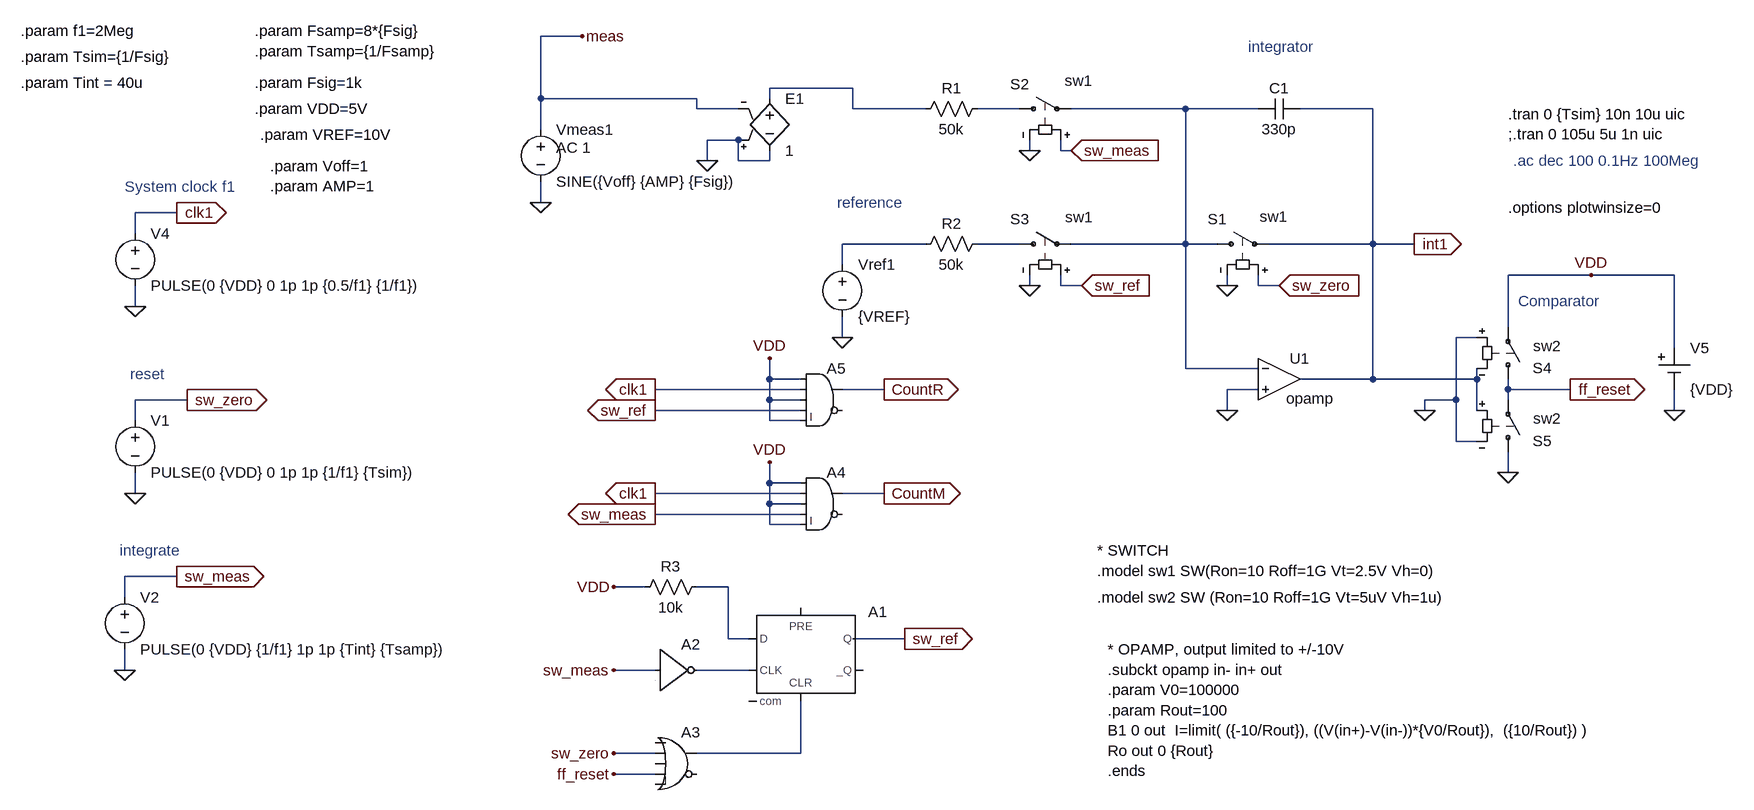
[diagram p0: schematic Dualslope_Integrating_RJI.asc]
Dualslope_Integrating_RJI.asc, the LTspice schematic file:
Version 4
SHEET 1 1400 1012
WIRE -672 -608 -736 -608
WIRE -256 -528 -384 -528
WIRE -736 -512 -736 -608
WIRE -496 -512 -736 -512
WIRE -384 -512 -384 -528
WIRE -496 -496 -496 -512
WIRE -432 -496 -496 -496
WIRE -256 -496 -256 -528
WIRE -144 -496 -256 -496
WIRE 0 -496 -64 -496
WIRE 256 -496 80 -496
WIRE 368 -496 256 -496
WIRE 544 -496 432 -496
WIRE -736 -464 -736 -512
WIRE -432 -448 -480 -448
WIRE 16 -432 16 -448
WIRE 64 -432 64 -448
WIRE 80 -432 64 -432
WIRE -480 -416 -480 -448
WIRE -432 -416 -432 -448
WIRE -384 -416 -384 -432
WIRE -384 -416 -432 -416
WIRE -736 -352 -736 -384
WIRE -1296 -336 -1360 -336
WIRE -1360 -304 -1360 -336
WIRE -144 -288 -272 -288
WIRE 0 -288 -64 -288
WIRE 256 -288 256 -496
WIRE 256 -288 80 -288
WIRE 304 -288 256 -288
WIRE 544 -288 544 -496
WIRE 544 -288 384 -288
WIRE 608 -288 544 -288
WIRE -272 -256 -272 -288
WIRE 880 -240 752 -240
WIRE 1008 -240 880 -240
WIRE 16 -224 16 -240
WIRE 64 -224 64 -240
WIRE 96 -224 64 -224
WIRE 320 -224 320 -240
WIRE 368 -224 368 -240
WIRE 400 -224 368 -224
WIRE -1360 -192 -1360 -224
WIRE 752 -160 752 -240
WIRE -272 -144 -272 -176
WIRE 704 -144 672 -144
WIRE 1008 -128 1008 -240
WIRE 256 -96 256 -288
WIRE 368 -96 256 -96
WIRE -384 -80 -384 -112
WIRE -336 -80 -384 -80
WIRE 544 -80 544 -288
WIRE 544 -80 432 -80
WIRE 704 -80 704 -96
WIRE 704 -80 544 -80
WIRE -336 -64 -560 -64
WIRE -208 -64 -272 -64
WIRE 368 -64 320 -64
WIRE 752 -64 752 -80
WIRE 848 -64 752 -64
WIRE -1280 -48 -1360 -48
WIRE -384 -48 -384 -80
WIRE -336 -48 -384 -48
WIRE 672 -48 672 -144
WIRE 672 -48 624 -48
WIRE 752 -48 752 -64
WIRE -336 -32 -560 -32
WIRE 320 -32 320 -64
WIRE 624 -32 624 -48
WIRE 704 -32 704 -80
WIRE 1008 -32 1008 -64
WIRE -1360 -16 -1360 -48
WIRE -384 -16 -384 -48
WIRE -336 -16 -384 -16
WIRE 672 16 672 -48
WIRE 704 16 672 16
WIRE 752 64 752 32
WIRE -384 80 -384 48
WIRE -336 80 -384 80
WIRE -1360 96 -1360 64
WIRE -336 96 -560 96
WIRE -208 96 -272 96
WIRE -384 112 -384 80
WIRE -336 112 -384 112
WIRE -336 128 -560 128
WIRE -384 144 -384 112
WIRE -336 144 -384 144
WIRE -1296 224 -1376 224
WIRE -576 240 -624 240
WIRE -448 240 -496 240
WIRE -1376 256 -1376 224
WIRE -448 320 -448 240
WIRE -416 320 -448 320
WIRE -176 320 -256 320
WIRE -1376 368 -1376 336
WIRE -560 368 -624 368
WIRE -416 368 -496 368
WIRE -560 496 -624 496
WIRE -336 496 -336 416
WIRE -336 496 -496 496
WIRE -560 528 -624 528
FLAG 16 -432 0
FLAG 16 -224 0
FLAG 80 -432 sw_meas
IOPIN 80 -432 In
FLAG 96 -224 sw_ref
IOPIN 96 -224 In
FLAG 320 -224 0
FLAG 400 -224 sw_zero
IOPIN 400 -224 In
FLAG -736 -352 0
FLAG -272 -144 0
FLAG -1360 96 0
FLAG -1376 368 0
FLAG -1280 -48 sw_zero
IOPIN -1280 -48 Out
FLAG -1296 224 sw_meas
IOPIN -1296 224 Out
FLAG -624 240 VDD
FLAG -624 368 sw_meas
FLAG 848 -64 ff_reset
IOPIN 848 -64 Out
FLAG -624 528 ff_reset
FLAG -176 320 sw_ref
IOPIN -176 320 Out
FLAG -624 496 sw_zero
FLAG -1296 -336 clk1
IOPIN -1296 -336 Out
FLAG -1360 -192 0
FLAG -672 -608 meas
FLAG 608 -288 int1
IOPIN 608 -288 Out
FLAG 624 -32 0
FLAG 752 64 0
FLAG 1008 -32 0
FLAG -208 96 CountM
IOPIN -208 96 Out
FLAG -560 96 clk1
IOPIN -560 96 Out
FLAG -560 128 sw_meas
IOPIN -560 128 Out
FLAG -384 48 VDD
FLAG -208 -64 CountR
IOPIN -208 -64 Out
FLAG -560 -64 clk1
IOPIN -560 -64 Out
FLAG -560 -32 sw_ref
IOPIN -560 -32 Out
FLAG -384 -112 VDD
FLAG -480 -416 0
FLAG 320 -32 0
FLAG 880 -240 VDD
SYMBOL cap 368 -480 R270
WINDOW 0 32 32 VTop 2
WINDOW 3 0 32 VBottom 2
SYMATTR InstName C1
SYMATTR Value 330p
SYMBOL sw 288 -288 R270
WINDOW 0 38 2 VRight 2
WINDOW 3 42 82 VRight 2
SYMATTR InstName S1
SYMATTR Value sw1
SYMBOL res -160 -480 R270
WINDOW 0 32 56 VTop 2
WINDOW 3 0 56 VBottom 2
SYMATTR InstName R1
SYMATTR Value 50k
SYMBOL sw -16 -496 R270
WINDOW 0 38 2 VRight 2
WINDOW 3 43 86 VRight 2
SYMATTR InstName S2
SYMATTR Value sw1
SYMBOL res -160 -272 R270
WINDOW 0 32 56 VTop 2
WINDOW 3 0 56 VBottom 2
SYMATTR InstName R2
SYMATTR Value 50k
SYMBOL sw -16 -288 R270
WINDOW 0 38 2 VRight 2
WINDOW 3 41 87 VRight 2
SYMATTR InstName S3
SYMATTR Value sw1
SYMBOL voltage -736 -480 R0
WINDOW 123 24 44 Left 2
WINDOW 39 0 0 Left 0
SYMATTR Value2 AC 1
SYMATTR InstName Vmeas1
SYMATTR Value SINE({Voff} {AMP} {Fsig})
SYMBOL voltage -272 -272 R0
WINDOW 123 0 0 Left 0
WINDOW 39 0 0 Left 0
SYMATTR InstName Vref1
SYMATTR Value {VREF}
SYMBOL voltage -1360 -32 R0
WINDOW 123 0 0 Left 0
WINDOW 39 0 0 Left 0
SYMATTR InstName V1
SYMATTR Value PULSE(0 {VDD} 0 1p 1p {1/f1} {Tsim})
SYMBOL voltage -1376 240 R0
WINDOW 123 0 0 Left 0
WINDOW 39 0 0 Left 0
SYMATTR InstName V2
SYMATTR Value PULSE(0 {VDD} {1/f1} 1p 1p {Tint} {Tsamp})
SYMBOL Digital\\dflop -336 272 R0
SYMATTR InstName A1
SYMATTR Value2 td=0.1n
SYMATTR SpiceLine Vhigh={VDD}
SYMBOL Digital\\inv -560 304 R0
SYMATTR InstName A2
SYMATTR SpiceLine Vhigh={VDD}
SYMBOL res -592 256 R270
WINDOW 0 32 56 VTop 2
WINDOW 3 0 56 VBottom 2
SYMATTR InstName R3
SYMATTR Value 10k
SYMBOL Digital\\or -528 448 R0
SYMATTR InstName A3
SYMATTR SpiceLine Vhigh={VDD}
SYMBOL voltage -1360 -320 R0
WINDOW 123 0 0 Left 0
WINDOW 39 0 0 Left 0
SYMATTR InstName V4
SYMATTR Value PULSE(0 {VDD} 0 1p 1p {0.5/f1} {1/f1})
SYMBOL sw 752 -64 M180
WINDOW 3 24 -12 Left 0
WINDOW 38 39 67 Left 2
WINDOW 0 38 33 Left 2
SYMATTR Value ""
SYMATTR SpiceModel sw2
SYMATTR InstName S4
SYMBOL sw 752 48 M180
WINDOW 3 24 -12 Left 0
WINDOW 38 39 67 Left 2
WINDOW 0 38 33 Left 2
SYMATTR Value ""
SYMATTR SpiceModel sw2
SYMATTR InstName S5
SYMBOL Misc\\cell 1008 -128 R0
SYMATTR InstName V5
SYMATTR Value {VDD}
SYMBOL Digital\\and -304 48 R0
SYMATTR InstName A4
SYMATTR SpiceLine Vhigh={VDD}
SYMBOL Digital\\and -304 -112 R0
SYMATTR InstName A5
SYMATTR SpiceLine Vhigh={VDD}
SYMBOL e2 -384 -528 R0
SYMATTR InstName E1
SYMATTR Value 1
SYMBOL Opamps\\opamp 400 -144 R0
WINDOW 3 11 94 Left 2
SYMATTR InstName U1
TEXT 752 -344 Left 2 !.options plotwinsize=0
TEXT 120 184 Left 2 !* SWITCH\n.model sw1 SW(Ron=10 Roff=1G Vt=2.5V Vh=0)
TEXT -1376 -376 Left 2 ;System clock f1
TEXT -1368 -88 Left 2 ;reset
TEXT -1384 184 Left 2 ;integrate
TEXT 352 -592 Left 2 ;integrator
TEXT -280 -352 Left 2 ;reference
TEXT 760 -416 Left 2 ;.ac dec 100 0.1Hz 100Meg
TEXT -1536 -616 Left 2 !.param f1=2Meg
TEXT -1536 -576 Left 2 !.param Tsim={1/Fsig}
TEXT -1536 -536 Left 2 !.param Tint = 40u
TEXT -1176 -616 Left 2 !.param Fsamp=8*{Fsig}\n.param Tsamp={1/Fsamp}
TEXT -1176 -536 Left 2 !.param Fsig=1k
TEXT 752 -488 Left 2 !.tran 0 {Tsim} 10n 10u uic\n;.tran 0 105u 5u 1n uic
TEXT -1176 -496 Left 2 !.param VDD=5V
TEXT -1152 -408 Left 2 !.param Voff=1\n.param AMP=1
TEXT 768 -200 Left 2 ;Comparator
TEXT 120 256 Left 2 !.model sw2 SW (Ron=10 Roff=1G Vt=5uV Vh=1u)
TEXT 136 336 Left 2 !* OPAMP, output limited to +/-10V\n.subckt opamp in- in+ out\n.param V0=100000\n.param Rout=100\nB1 0 out  I=limit( ({-10/Rout}), ((V(in+)-V(in-))*{V0/Rout}),  ({10/Rout}) )\nRo out 0 {Rout}\n.ends
TEXT -1168 -456 Left 2 !.param VREF=10V

The netlist it stands for:
* Dualslope_Integrating_RJI.asc
C1 N003 int1 330p
S1 N003 int1 sw_zero 0 sw1
R1 N001 N002 50k
S2 N002 N003 sw_meas 0 sw1
R2 N004 N005 50k
S3 N005 N003 sw_ref 0 sw1
Vmeas1 meas 0 SINE({Voff} {AMP} {Fsig}) AC 1
Vref1 N004 0 {VREF}
V1 sw_zero 0 PULSE(0 {VDD} 0 1p 1p {1/f1} {Tsim})
V2 sw_meas 0 PULSE(0 {VDD} {1/f1} 1p 1p {Tint} {Tsamp})
A1 N006 0 N007 0 N008 0 sw_ref 0 DFLOP td=0.1n Vhigh={VDD}
A2 sw_meas 0 0 0 0 N007 0 0 BUF Vhigh={VDD}
R3 VDD N006 10k
A3 0 sw_zero 0 ff_reset 0 0 N008 0 OR Vhigh={VDD}
V4 clk1 0 PULSE(0 {VDD} 0 1p 1p {0.5/f1} {1/f1})
S4 ff_reset VDD 0 int1 sw2
S5 0 ff_reset int1 0 sw2
V5 VDD 0 {VDD}
A4 VDD clk1 VDD sw_meas VDD 0 CountM 0 AND Vhigh={VDD}
A5 VDD clk1 VDD sw_ref VDD 0 CountR 0 AND Vhigh={VDD}
E1 N001 0 0 meas 1
XU1 N003 0 int1 opamp Aol=100K GBW=10Meg  ; pins invin noninvin out
.options plotwinsize=0
* SWITCH
.model sw1 SW(Ron=10 Roff=1G Vt=2.5V Vh=0)
* System clock f1
* reset
* integrate
* integrator
* reference
* .ac dec 100 0.1Hz 100Meg
.param f1=2Meg
.param Tsim={1/Fsig}
.param Tint = 40u
.param Fsamp=8*{Fsig}
.param Tsamp={1/Fsamp}
.param Fsig=1k
.tran 0 {Tsim} 10n 10u uic
;.tran 0 105u 5u 1n uic
.param VDD=5V
.param Voff=1
.param AMP=1
* Comparator
.model sw2 SW (Ron=10 Roff=1G Vt=5uV Vh=1u)
* OPAMP, output limited to +/-10V
.subckt opamp in- in+ out
.param V0=100000
.param Rout=100
B1 0 out  I=limit( ({-10/Rout}), ((V(in+)-V(in-))*{V0/Rout}),  ({10/Rout}) )
Ro out 0 {Rout}
.ends
.param VREF=10V
.backanno
.end